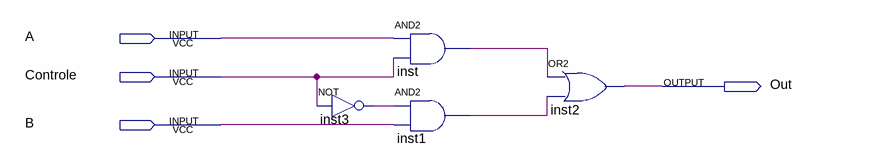
[diagram p0: schematic sheet]
// Quartus schematic AouB.bdf as structural Verilog: 4 symbols, 4 pins
module AouB (
  input  A,
  input  Controle,
  input  B,
  output Out
);

  wire inst1_out, inst3_out, inst_out;

  not inst3 (inst3_out, Controle);
  and inst (inst_out, A, Controle);
  and inst1 (inst1_out, inst3_out, B);
  or inst2 (Out, inst_out, inst1_out);
endmodule
